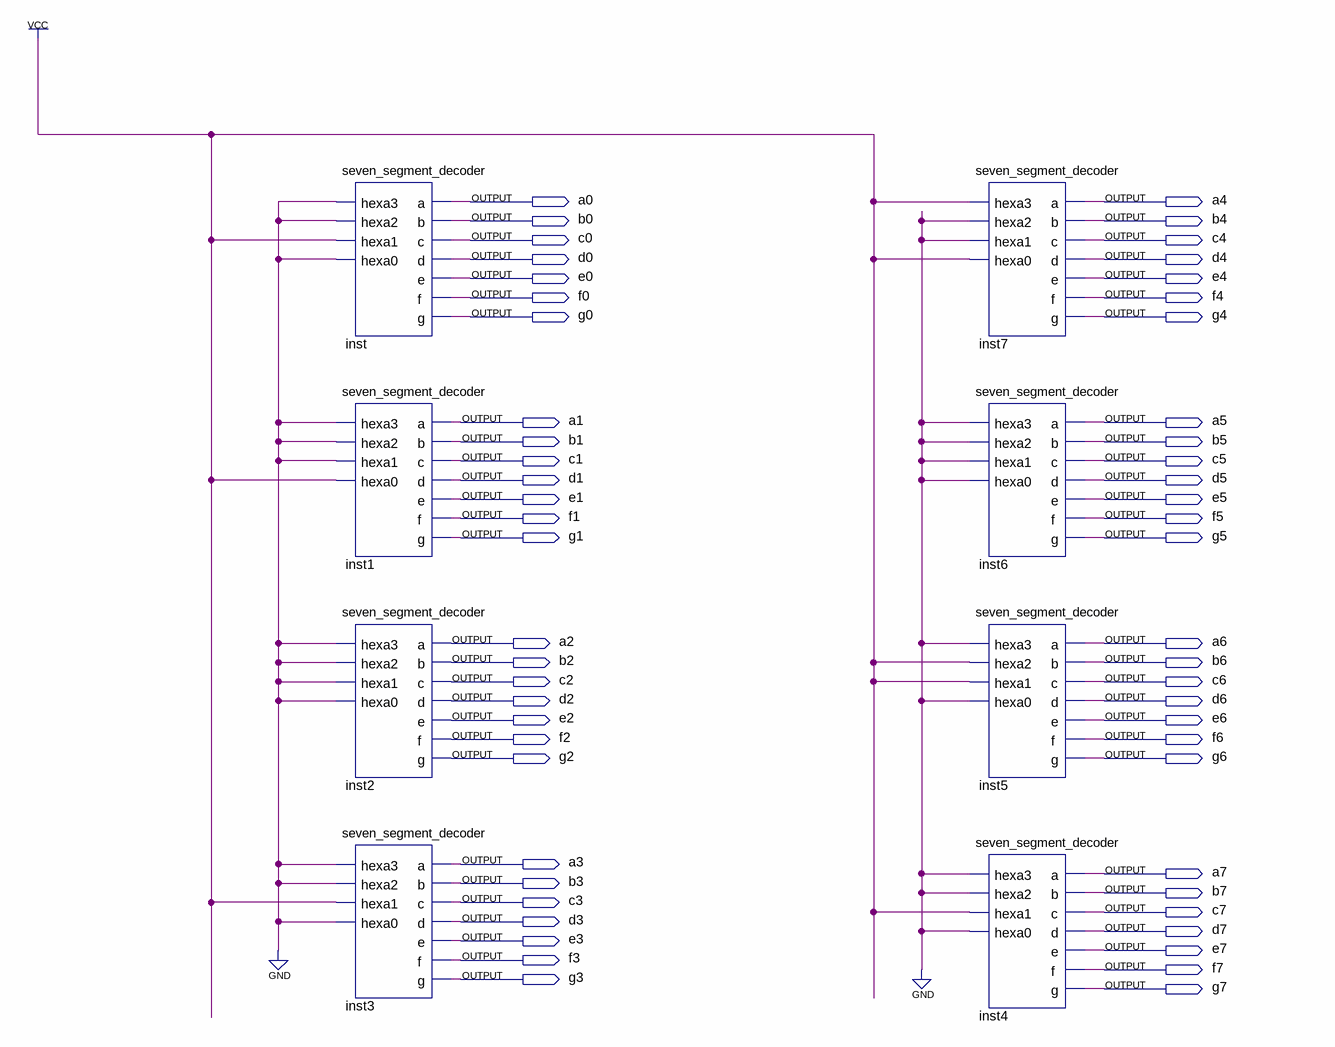
[diagram p0: schematic sheet]
// Quartus schematic design3.bdf as structural Verilog: 8 symbols, 56 pins
module design3 (
  output a0,
  output a4,
  output b0,
  output b4,
  output c0,
  output c4,
  output d0,
  output d4,
  output e0,
  output e4,
  output f0,
  output f4,
  output g0,
  output g4,
  output a1,
  output a5,
  output b1,
  output b5,
  output c1,
  output c5,
  output d1,
  output d5,
  output e1,
  output e5,
  output f1,
  output f5,
  output g1,
  output g5,
  output a2,
  output a6,
  output b2,
  output b6,
  output c2,
  output c6,
  output d2,
  output d6,
  output e2,
  output e6,
  output f2,
  output f6,
  output g2,
  output g6,
  output a3,
  output a7,
  output b3,
  output b7,
  output c3,
  output c7,
  output d3,
  output d7,
  output e3,
  output e7,
  output f3,
  output f7,
  output g3,
  output g7
);

  seven_segment_decoder inst (
    .hexa3(1'b0), .hexa2(1'b0), .hexa1(1'b1), .hexa0(1'b0), .a(a0), .b(b0), .c(c0), .d(d0), .e(e0), .f(f0),
    .g(g0));
  seven_segment_decoder inst1 (
    .hexa3(1'b0), .hexa2(1'b0), .hexa1(1'b0), .hexa0(1'b1), .a(a1), .b(b1), .c(c1), .d(d1), .e(e1), .f(f1),
    .g(g1));
  seven_segment_decoder inst2 (
    .hexa3(1'b0), .hexa2(1'b0), .hexa1(1'b0), .hexa0(1'b0), .a(a2), .b(b2), .c(c2), .d(d2), .e(e2), .f(f2),
    .g(g2));
  seven_segment_decoder inst3 (
    .hexa3(1'b0), .hexa2(1'b0), .hexa1(1'b1), .hexa0(1'b0), .a(a3), .b(b3), .c(c3), .d(d3), .e(e3), .f(f3),
    .g(g3));
  seven_segment_decoder inst7 (
    .hexa3(1'b1), .hexa2(1'b0), .hexa1(1'b0), .hexa0(1'b1), .a(a4), .b(b4), .c(c4), .d(d4), .e(e4), .f(f4),
    .g(g4));
  seven_segment_decoder inst6 (
    .hexa3(1'b0), .hexa2(1'b0), .hexa1(1'b0), .hexa0(1'b0), .a(a5), .b(b5), .c(c5), .d(d5), .e(e5), .f(f5),
    .g(g5));
  seven_segment_decoder inst5 (
    .hexa3(1'b0), .hexa2(1'b1), .hexa1(1'b1), .hexa0(1'b0), .a(a6), .b(b6), .c(c6), .d(d6), .e(e6), .f(f6),
    .g(g6));
  seven_segment_decoder inst4 (
    .hexa3(1'b0), .hexa2(1'b0), .hexa1(1'b1), .hexa0(1'b0), .a(a7), .b(b7), .c(c7), .d(d7), .e(e7), .f(f7),
    .g(g7));
endmodule
